# EAGLE design LightFlicker (EAGLE 5.11)
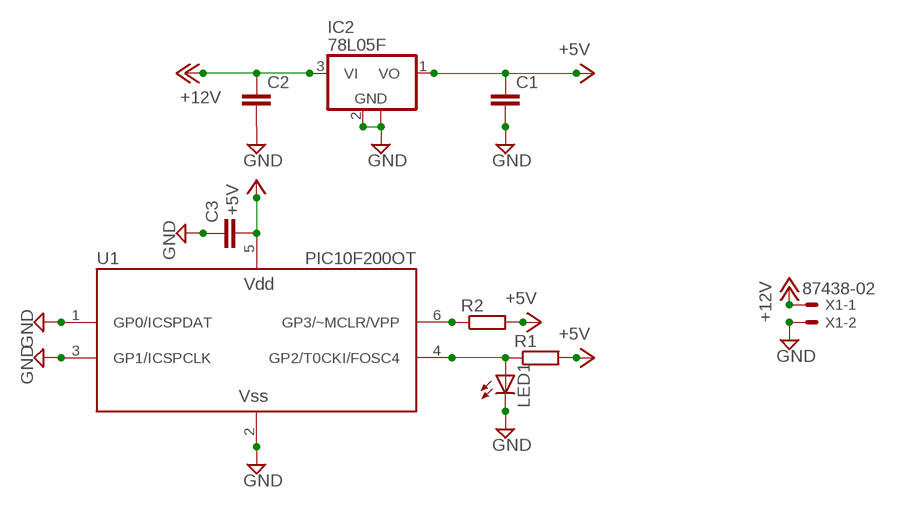
[diagram p0: schematic, sheet 1]

## Parts
C1  C-EUC0201  [C0201]
C2  C-EUC0201  [C0201]
C3  C-EUC0201  [C0201]
IC2  78L05F  [SOT89]
LED1  LEDCHIP-LED0603  [CHIP-LED0603]
R1  R-EU_R0201  [R0201]
R2  R-EU_R0201  [R0201]
U1  PIC10F200OT  [SOT-23-6]
X1  87438-02  [87438-02]

## Nets
+5V: C1.1 C3.2 IC2.1(VO) R1.2 R2.2 U1.5(VDD)
+12V: C2.1 IC2.3(VI) X1.1
GND: C1.2 C2.2 C3.1 IC2.2(GND) IC2.2@1(GND) LED1.C U1.1(GP0/ICSPDAT) U1.2(VSS) U1.3(GP1/ICSPCLK) X1.2
N$1: LED1.A R1.1 U1.4(GP2/T0CKI/FOSC4)
N$2: R2.1 U1.6(GP3/~MCLR/VPP)

## Library data of the parts
C1-C3 = rcl:C-EU: CAPACITOR, European symbol
IC2 = linear:78L*: POSITOIV-VOLTAGE REGULATORS Output up to 100 mA Source: http://focus.ti.com/lit/ds/symlink/ua78l05.pdf
LED1 = led:LED: LED OSRAM: - CHIPLED LG R971, LG N971, LY N971, LG Q971, LY Q971, LO R971, LY R971 LH N974, LH R974 LS Q976, LO Q976, LY Q976 LO Q996 - Hyper CHIPLED LW Q18S LB Q993, LB Q99A, LB R99A - SideLED LS A670, LO A670, LY A670, LG A670, LP A670 LB A673, LV A673, LT A673, LW A673 LH A674 LY A675 LS A676, LA A676, LO A676, LY A676, LW A676 LS A679, LY A679, LG A679 - Hyper Micro SIDELED® LS Y876, LA Y876, LO Y876, LY Y876 LT Y87S - SmartLED LW L88C, LW L88S LB L89C, LB L89S, LG L890 LS L89K, LO L89K, LY L89K LS L896, LA L896, LO L896, LY L896 - TOPLED LS T670, LO T670, LY T670, LG T670, LP T670 LSG T670, LSP T670, LSY T670, LOP T670, LYG T670 LG T671, LOG T671, LSG T671 LB T673, LV T673, LT T673, LW T673 LH T674 LS T676, LA T676, LO T676, LY T676, LB T676, LH T676, LSB T676, LW T676 LB T67C, LV T67C, LT T67C, LS T67K, LO T67K, LY T67K, LW E67C LS E67B, LA E67B, LO E67B, LY E67B, LB E67C, LV E67C, LT E67C LW T67C LS T679, LY T679, LG T679 LS T770, LO T770, LY T770, LG T770, LP T770 LB T773, LV T773, LT T773, LW T773 LH T774 LS E675, LA E675, LY E675, LS T675 LS T776, LA T776, LO T776, LY T776, LB T776 LHGB T686 LT T68C, LB T68C - Hyper Mini TOPLED® LB M676 - Mini TOPLED Santana® LG M470 LS M47K, LO M47K, LY M47K Source: http://www.osram.convergy.de LUXEON: - LUMILED® LXK2-PW12-R00, LXK2-PW12-S00, LXK2-PW14-U00, LXK2-PW14-V00 LXK2-PM12-R00, LXK2-PM12-S00, LXK2-PM14-U00 LXK2-PE12-Q00, LXK2-PE12-R00, LXK2-PE12-S00, LXK2-PE14-T00, LXK2-PE14-U00 LXK2-PB12-K00, LXK2-PB12-L00, LXK2-PB12-M00, LXK2-PB14-N00, LXK2-PB14-P00, LXK2-PB14-Q00 LXK2-PR12-L00, LXK2-PR12-M00, LXK2-PR14-Q00, LXK2-PR14-R00 LXK2-PD12-Q00, LXK2-PD12-R00, LXK2-PD12-S00 LXK2-PH12-R00, LXK2-PH12-S00 LXK2-PL12-P00, LXK2-PL12-Q00, LXK2-PL12-R00 Source: www.luxeon.com KINGBRIGHT: KA-3528ASYC Source: www.kingbright.com
R1 R2 = rcl:R-EU_: RESISTOR, European symbol
U1 = microchip:PIC10F20*: Microchip PIC10F200, 202, 204 and 206 6-pin 8-bit Flash microcontroller 256/512 words program memory, 16/24 bytes RAM 4 I/O, 1 8-bit timer, 1 comparator on PIC10F204 and PIC10F206
X1 = con-molex:87438-02: Wire-to-Board 1.50mm (.059") Pitch Header - Right Angle, SMT, Shrouded Source: http://www.molex.com/product/micro/87438.html; OC_FARNELL: 1711327; OC_NEWARK: unknown

## Board
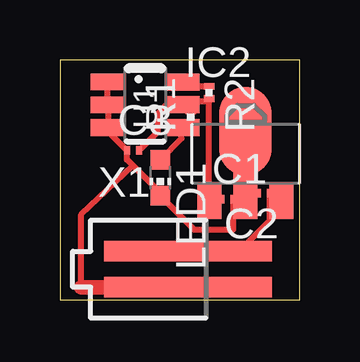
[diagram p1: board, top side]

Size 10 x 10 mm. Coordinates in mm from the lower left corner, seen from the top.
Outline: 0,0 10,0 10,10 0,10 0,0
Copper layers (1*16): Top 0.035mm / dielectric 1.5mm / Bottom 0.035mm
Design rules "default": minimum track width 10mil, minimum drill 24mil, track to track 8mil, track to pad 8mil, pad to pad 8mil, via to via 8mil, smd to smd 8mil, copper to edge 40mil, drill to drill 8mil, minimum pad ring 10mil, minimum via ring 8mil, stop-mask expansion 4mil, vias tented up to drill 0mil, thermal gap 10mil

### Footprints (pad centres in the part's own frame; a part is rotated, then mirrored left to right if it is on the bottom)
C0201 = smd 0.25 x 0.35: 1 -0.25,0; 2 0.25,0
SOT89 = smd 1 x 1.5: 1 -1.499,-1.981; 3 1.499,-1.981 | smd 1 x 2: 2 0,-1.727 | smd 2.2 x 3.7: 2@1 0,0.94
CHIP-LED0603 = smd 0.8 x 0.8: A 0,-0.75; C 0,0.75
R0201 = smd 0.28 x 0.43: 1 -0.255,0; 2 0.255,0
SOT-23-6 = smd 0.7 x 1.4: 1 -0.953,-1.57; 2 0,-1.57; 3 0.953,-1.57; 4 0.953,1.57; 5 -0.003,1.57; 6 -0.95,1.57
87438-02 = smd 7 x 0.85: 1 0,0.75; 2 0,-0.75

### Placement (x,y rotation side)
C1  6.99,4.19 0 top
C2  8.51,4.45 180 top
C3  3.05,6.22 0 top
IC2  7.75,6.1 0 top
LED1  4.19,5.08 180 top
R1  5.46,7.62 90 top
R2  6.22,8.64 270 top
U1  3.56,8.13 270 top
X1  5.33,1.27 0 top

### Tracks (layer width: path | path; a pad name or v marks a point on that pad's centre or on a via)
+5V
  Top 0.254: C1.1 6.35,4.19 IC2.1 6.35,4.32 6.22,4.45 6.22,8.26 | C3.2 4.06,6.99 4.06,7.75 4.45,8.13 5.08,8.13 U1.5 | R1.2 5.46,8 5.21,8.26 U1.5 | 6.22,8.26 5.33,8.26 U1.5 | 6.22,8.26 R2.2
+12V
  Top 0.254: X1.1 5.33,2.03 7.49,2.03 8.76,3.3 C2.1 9.25,4.45 IC2.3
GND
  Top 0.254: C3.1 2.03,6.99 2.03,7.11 U1.3 2.03,7.24 2.03,8.13 U1.2 U1.1 | 3.05,5.59 2.79,5.84 C3.1 | 3.05,5.59 4.19,4.45 LED1.C 4.19,4.32 5.59,2.92 7.24,2.92 C1.2 | C3.1 | C1.2 7.75,4.19 IC2.2 7.75,4.45 | 7.75,4.45 C2.2 | 7.75,4.45 IC2.2@1 | C1.2 | 0.89,0.51 0.89,3.56 3.05,5.59
  Top 0.61: 0.89,0.51 X1.2
N$1
  Top 0.254: R1.1 5.46,7.24 5.21,7.24 U1.4 5.08,7.11 5.08,6.73 4.19,5.84 LED1.A
N$2
  Top 0.254: R2.1 5.13,8.89 U1.6